# EAGLE schematic phoneline_fixer_v2.0 (EAGLE 9.6.2)
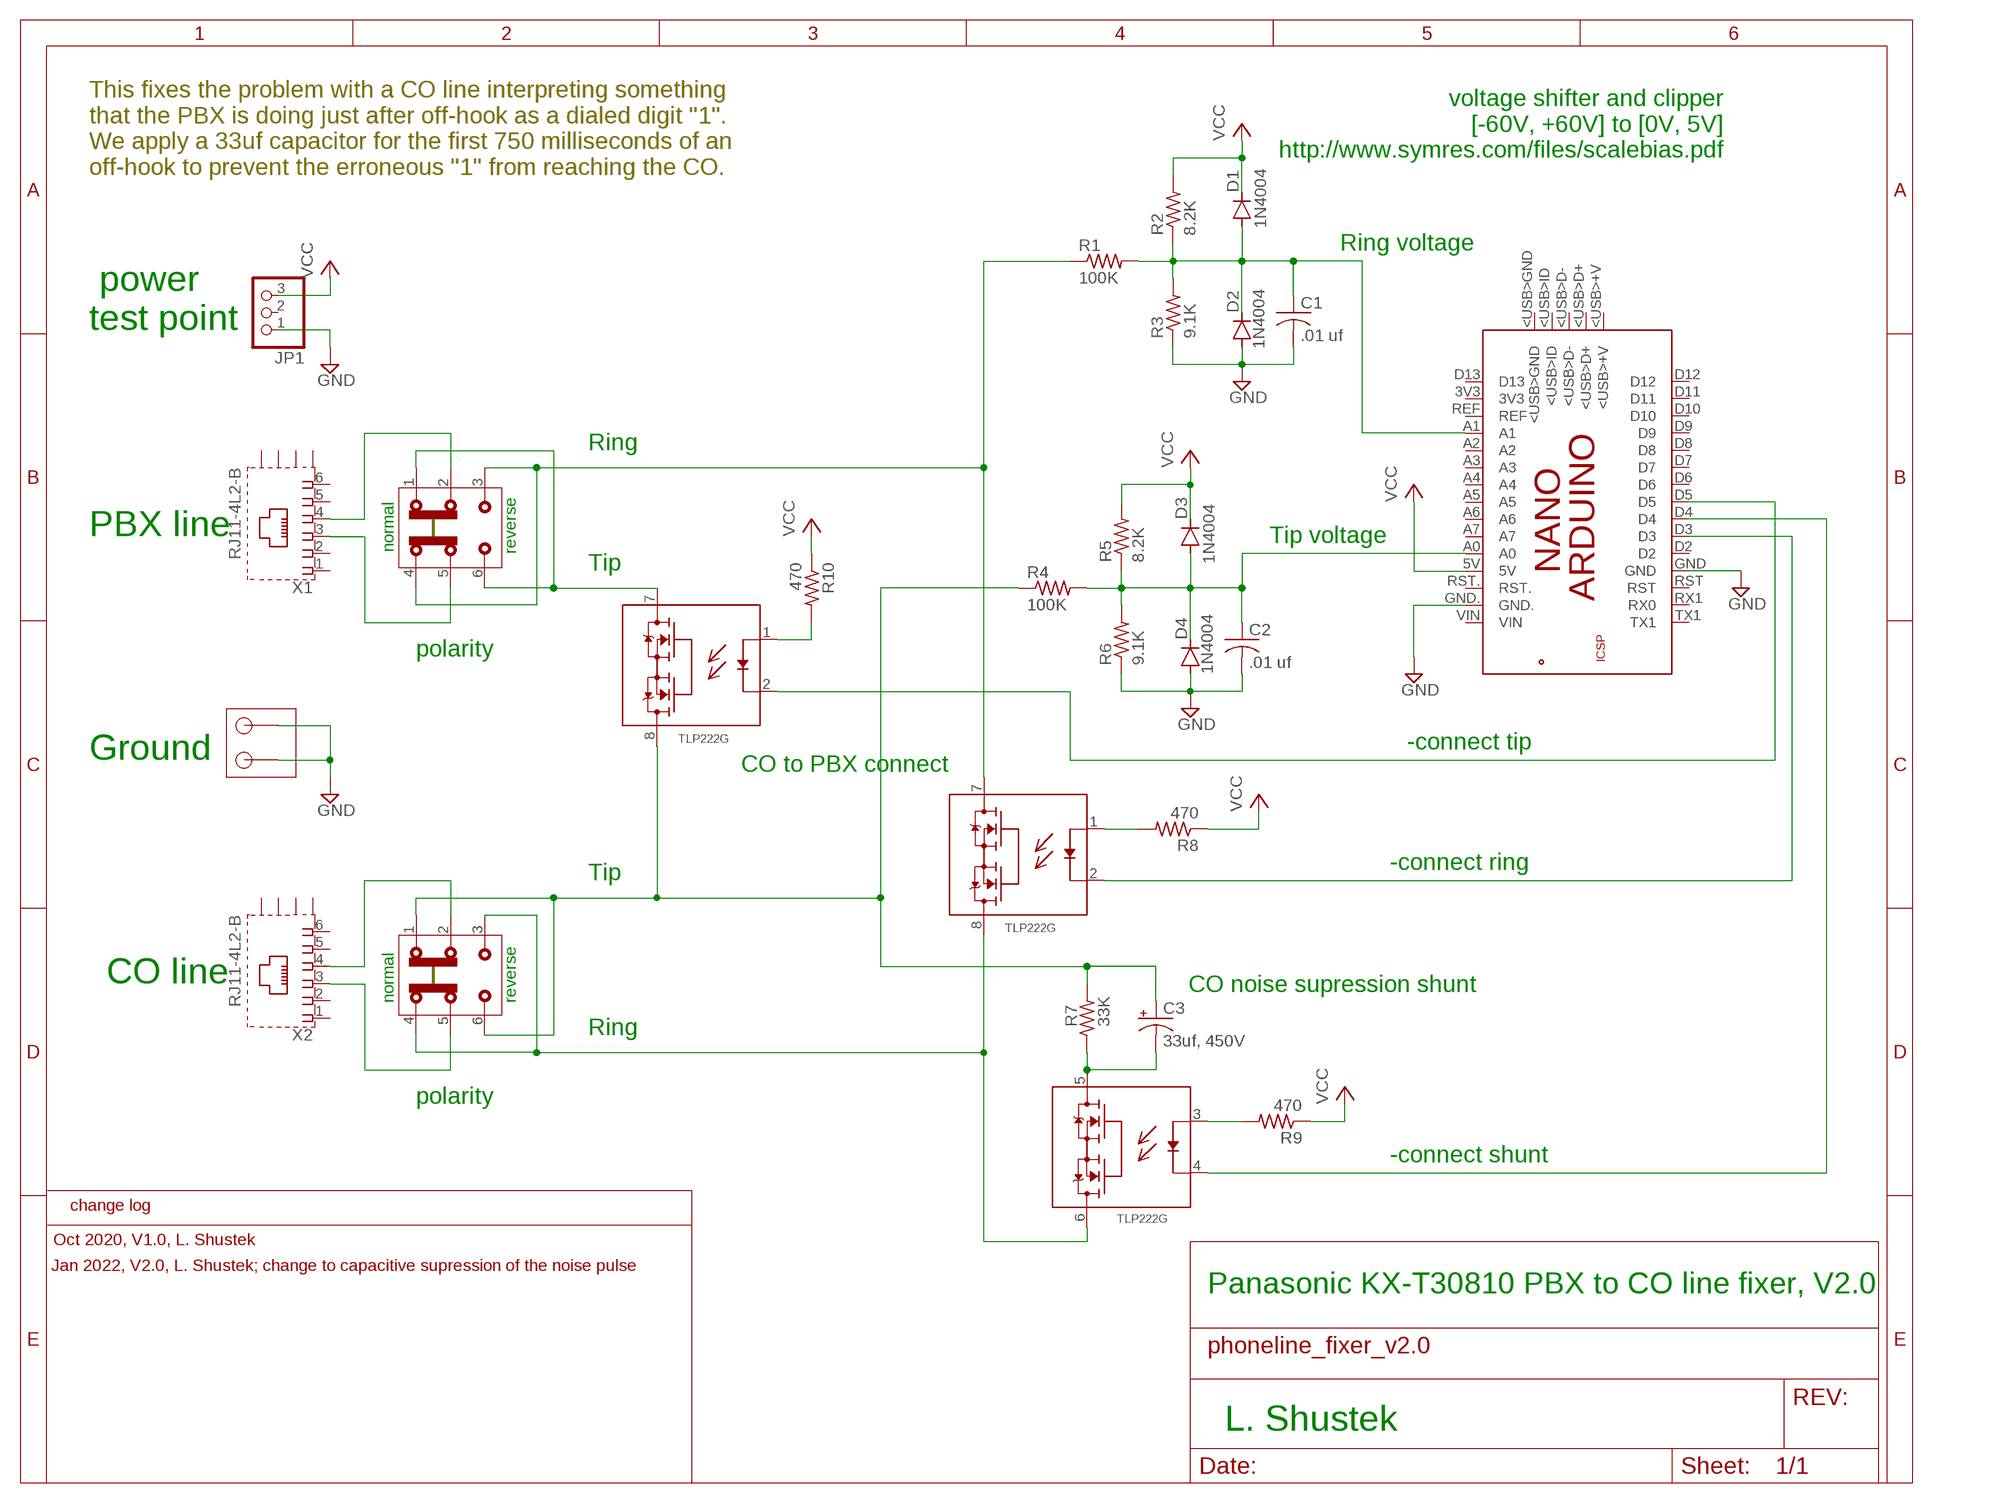
[diagram p0: schematic, sheet 1]

## Parts
C1  .01 uf  C-US050-025X075  [C050-025X075]
C2  .01 uf  C-US050-025X075  [C050-025X075]
C3  33uf, 450V  CPOL-USE7.5-18  [E7,5-18]
D1  1N4004  [DO41-10]
D2  1N4004  [DO41-10]
D3  1N4004  [DO41-10]
D4  1N4004  [DO41-10]
JP1  PINHD-1X3  [1X03]
PCB1  ARDUINO_NANO  [ARDUINO_NANO]
R1  100K  R-US_0207/12  [0207/12]
R2  8.2K  R-US_0207/12  [0207/12]
R3  9.1K  R-US_0207/12  [0207/12]
R4  100K  R-US_0207/12  [0207/12]
R5  8.2K  R-US_0207/12  [0207/12]
R6  9.1K  R-US_0207/12  [0207/12]
R7  33K  R-US_0414/15  [0414/15]
R8  470  R-US_0207/12  [0207/12]
R9  470  R-US_0207/12  [0207/12]
R10  470  R-US_0207/12  [0207/12]
U$1  TLP222G  PHOTORELAY  [DIL08]
U$2  CONNECTOR-2PINTHIN  [CONNECTOR-2PIN-5MM_THIN]
U$3  SWITCH_SLIDE_DPDT  [SWITCH_SLIDE_DPDT]
U$4  SWITCH_SLIDE_DPDT  [SWITCH_SLIDE_DPDT]
U$5  TLP222G  PHOTORELAY  [DIL08]
X1  RJ11-4L2-B  [RJ11-SHIELD2]
X2  RJ11-4L2-B  [RJ11-SHIELD2]

## Nets
GND: C1.2 C2.2 D2.A D4.A JP1.1 PCB1.GND PCB1.GND. R3.1 R6.1 U$2.P$1 U$2.P$2
N$1: C1.1 D1.A D2.C PCB1.A1 R1.2 R2.1 R3.2
N$2: C2.1 D3.A D4.C PCB1.A0 R4.2 R5.1 R6.2
N$3: U$3.1 U$3.6 U$5.7(G$1A:D2)
N$4: C3.- R7.1 U$1.5(G$1B:D2)
N$5: R10.2 U$5.1(G$1A:A)
N$6: R8.2 U$1.1(G$1A:A)
N$7: PCB1.D5 U$5.2(G$1A:C)
N$8: R9.2 U$1.3(G$1B:A)
N$9: U$4.5 X2.3
N$10: U$4.2 X2.4
N$11: PCB1.D3 U$1.2(G$1A:C)
N$12: PCB1.D4 U$1.4(G$1B:C)
N$13: C3.+ R4.1 R7.2 U$4.1 U$4.6 U$5.8(G$1A:D1)
N$14: U$1.6(G$1B:D1) U$1.8(G$1A:D1) U$4.3 U$4.4
N$15: U$3.5 X1.3
N$16: U$3.2 X1.4
N$18: R1.1 U$1.7(G$1A:D2) U$3.3 U$3.4
VCC: D1.C D3.C JP1.3 PCB1.5V R2.2 R5.2 R8.1 R9.1 R10.1
Unconnected: JP1.2 PCB1.3V3 PCB1.5V. PCB1.<USB>+V PCB1.<USB>D+ PCB1.<USB>D- PCB1.<USB>GND PCB1.<USB>ID PCB1.A2 PCB1.A3 PCB1.A4 PCB1.A5 PCB1.A6 PCB1.A7 PCB1.D2 PCB1.D6 PCB1.D7 PCB1.D8 PCB1.D9 PCB1.D10 PCB1.D11 PCB1.D12 PCB1.D13 PCB1.GND_ PCB1.MISO PCB1.MOSI PCB1.REF PCB1.RESET.. PCB1.RST PCB1.RST. PCB1.RX1(RX0) PCB1.SCK PCB1.TX1 PCB1.VIN U$5.3(G$1B:A) U$5.4(G$1B:C) U$5.5(G$1B:D2) U$5.6(G$1B:D1) X1.1 X1.2 X1.5 X1.6 X1.S1(S) X1.S2(S) X1.S3(S) X1.S4(S) X2.1 X2.2 X2.5 X2.6 X2.S1(S) X2.S2(S) X2.S3(S) X2.S4(S)

## Notes on the sheet
- voltage shifter and clipper
   [-60V, +60V] to [0V, 5V]
  http://www.symres.com/files/scalebias.pdf
- This fixes the problem with a CO line interpreting something 
  that the PBX is doing just after off-hook as a dialed digit "1". 
  We apply a 33uf capacitor for the first 750 milliseconds of an
  off-hook to prevent the erroneous "1" from reaching the CO.
- Ring voltage
- power
  test point
- Ring
- PBX line | Tip voltage
- normal | reverse
- Tip
- polarity
- -connect tip
- Ground
- CO to PBX connect
- -connect ring
- Tip
- CO line
- CO noise supression shunt
- normal | reverse
- Ring
- polarity
- -connect shunt
- change log
- Oct 2020, V1.0, L. Shustek
- Jan 2022, V2.0, L. Shustek; change to capacitive supression of the noise pulse
- Panasonic KX-T30810 PBX to CO line fixer, V2.0
- L. Shustek

## Library data of the parts
C1 C2 = resistor:C-US: CAPACITOR, American symbol
C3 = resistor:CPOL-US: POLARIZED CAPACITOR, American symbol
D1-D4 = Len:1N4004: DIODE general purpose rectifier, 1 A
JP1 = pinhead:PINHD-1X3: PIN HEADER
PCB1 = Ardunio_E14:ARDUINO_NANO: Device for representing an Arduino Nano board with a footprint in an EAGLE design. Created by Dave Young for Element14. More EAGLE documentation at: http://www.element14.com/community/community/knode/cadsoft_eagle
R1-R10 = resistor:R-US_: RESISTOR, American symbol
U$1 U$5 = Len:PHOTORELAY
U$2 = Len:CONNECTOR-2PIN
U$3 U$4 = Len:SWITCH_SLIDE_DPDT: DPDT slide switch
X1 X2 = con-tycoelectronics:RJ11*2: RJ11 (Style 1 Shield / Style 2 Shield) Source: www.tycoelectronics.com .. ENG_DS_1654001_1099_RJ_L_0507.pdf; MF: TYCO ELECTRONICS; MPN: RJ11-4L2-B; OC_FARNELL: unknown; OC_NEWARK: 50F8856

## Net classes
0 default: width 0.635 mm, clearance 0.381 mm